# Altium schematic sheet peripherals.SchDoc
size A4
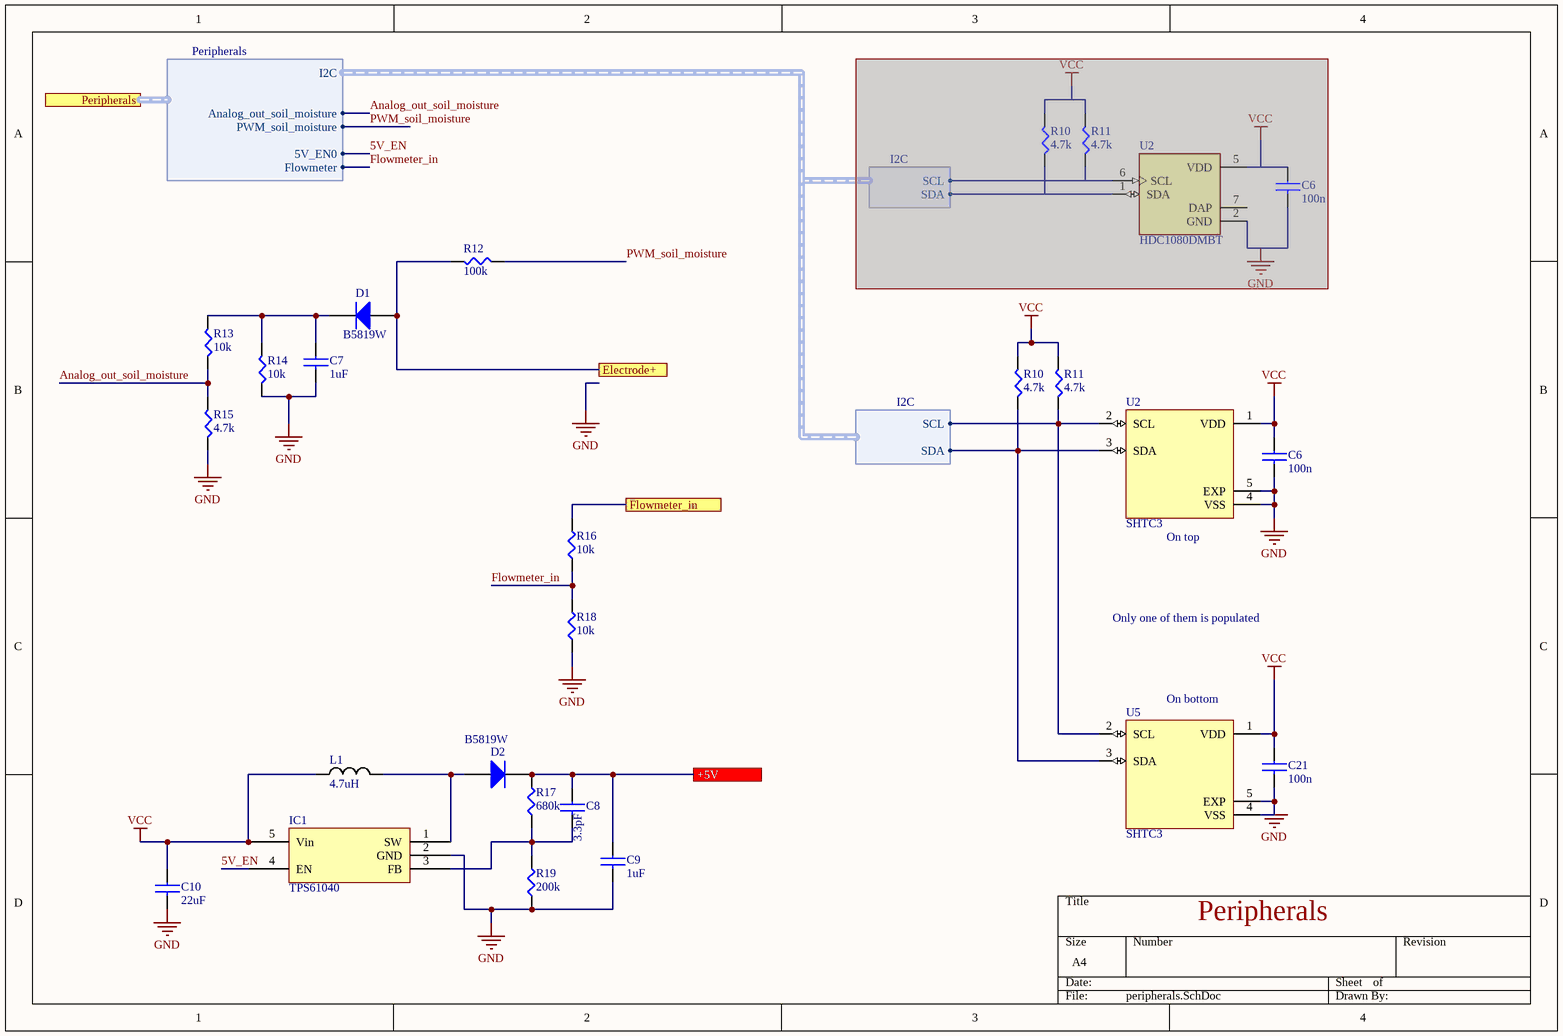
[diagram p0: peripherals.SchDoc]

## Parts
(Parts that share a designator on the sheet are numbered #1, #2 ... from top to bottom, then left to right.)
C6#1  100n  [CAPC160X80X90L35N]  (masked out: inside a compile mask, not in the netlist)
C6#2  100n  [CAPC160X80X90L35N]
C7  1uF  [CAPC200X125X110L50N]
C8  3.3pF  [CAPC160X80X90L35N]
C9  1uF  [CAPC200X125X110L50N]
C10  22uF  [CAPC200X125X110L50N]
C21  100n  [CAPC160X80X90L35N]
D1  B5819W  [SODFL350X110-2N]
D2  B5819W  [SODFL350X110-2N]
IC1  TPS61040  [SOT23-5]
L1  4.7uH  [INDM320X250X240L55X190N]
R10#1  4.7k  [RESC200X125X70L40N]  (masked out: inside a compile mask, not in the netlist)
R10#2  4.7k  [RESC200X125X70L40N]
R11#1  4.7k  [RESC200X125X70L40N]  (masked out: inside a compile mask, not in the netlist)
R11#2  4.7k  [RESC200X125X70L40N]
R12  100k  [RESC160X80X90L30N]
R13  10k  [RESC200X125X70L40N]
R14  10k  [RESC200X125X70L40N]
R15  4.7k  [RESC200X125X70L40N]
R16  10k  [RESC200X125X70L40N]
R17  680k  [RESC200X125X70L40N]
R18  10k  [RESC200X125X70L40N]
R19  200k  [RESC200X125X70L40N]
U2#1  HDC1080DMBT  [SON100P300X300X80-7N]  (masked out: inside a compile mask, not in the netlist)
U2#2  SHTC3  [SHTCx]
U5  SHTC3  [SHTCx]

## Ports
+5V, Electrode+, Flowmeter_in, Peripherals (harness Peripherals)

## Harnesses
Peripherals: I2C, Analog_out_soil_moisture, PWM_soil_moisture, 5V_EN0, Flowmeter
I2C: SCL, SDA

## Nets
GND: C6#2.2 C7.2 C9.2 C10.2 C21.2 IC1.2(GND) R14.1 R15.1 R18.1 R19.1 U2#2.4(VSS) U2#2.5(EXP) U5.4(VSS) U5.5(EXP)
VCC: C6#2.1 C10.1 C21.1 IC1.5(Vin) L1.1 R10#2.2 R11#2.2 U2#2.1(VDD) U5.1(VDD)
5V_EN: IC1.4(EN) ; port Peripherals.5V_EN0
+5V: C8.1 C9.1 D2.C R17.2 ; port +5V
Analog_out_soil_moisture: R13.1 R15.2 ; port Peripherals.Analog_out_soil_moisture
Electrode+: D1.A R12.2 ; port Electrode+
Flowmeter_in: R16.1 R18.2 ; port Peripherals.Flowmeter
Flowmeter_in: R16.2 ; port Flowmeter_in  [a separate net that carries the same name]
PWM_soil_moisture: R12.1 ; port Peripherals.PWM_soil_moisture
NetC7_1: C7.1 D1.C R13.2 R14.2
NetC8_2: C8.2 IC1.3(FB) R17.1 R19.2
NetD2_A: D2.A IC1.1(SW) L1.2
NetR10#2_1: R10#2.1 U2#2.3(SDA) U5.3(SDA) ; harness I2C.SDA
NetR11#2_1: R11#2.1 U2#2.2(SCL) U5.2(SCL) ; harness I2C.SCL

## Notes on the sheet
- (near U2#2) On top
- Only one of them is populated
- (near U5) On bottom
- Peripherals

## Library data of the parts
C6#1 C6#2 C7 C9 C10 C21 = Capacitor: Part Number: *; Package: *
  C6#1 C21: Value: 100n; LCSC Part #: C14663
  C6#2: Value: 100n
  C7 C9: Value: 1uF; LCSC Part #: C15849
  C10: Value: 22uF; LCSC Part #: C59461
C8 = Capacitor: Optional; Value: 3.3pF; Part Number: *; LCSC Part #: C46219; Package: *; Parameter 1: *
D1 D2 = Diode: Part Number: B5819W; LCSC Part #: C8598
L1 = INDUCTOR: LCSC Part #: C1049; Value: 4.7uH
R10#1 R10#2 R11#1 R11#2 R12-R19 = Resistor: Part Number: *; Package: *
  R10#1 R10#2 R11#1 R11#2 R15: Value: 4.7k; LCSC Part #: C17673
  R12: Value: 100k; LCSC Part #: C17407
  R13 R14 R16 R18: Value: 10k; LCSC Part #: C17414
  R17: Value: 680k; LCSC Part #: C17797
  R19: Value: 200k; LCSC Part #: C17539
U2#1 = HDC1080DMBT: Humidity Temperature Sensor 0 ~ 100% RH IÂ²C Â±2% RH 15s Surface Mount; MF: Texas Instruments; Package: WDFN-6 Texas Instruments; Value: *; Price: None; MP: HDC1080DMBT; Availability: Unavailable; SnapEDA_Link: https://www.snapeda.com/parts/HDC1080DMBT/Texas%20Instruments/view-part/472820/?ref=snap; LCSC Part #: C82227
U2#2 U5 = SHTCx
  U5: LCSC Part #: C194656
IC1 = TPS61040: LCSC Part #: C7722; Part Number: TPS61040